# Altium schematic sheet USB_PHY.SchDoc
size A4; SheetNumber: 4; SheetTotal: 10
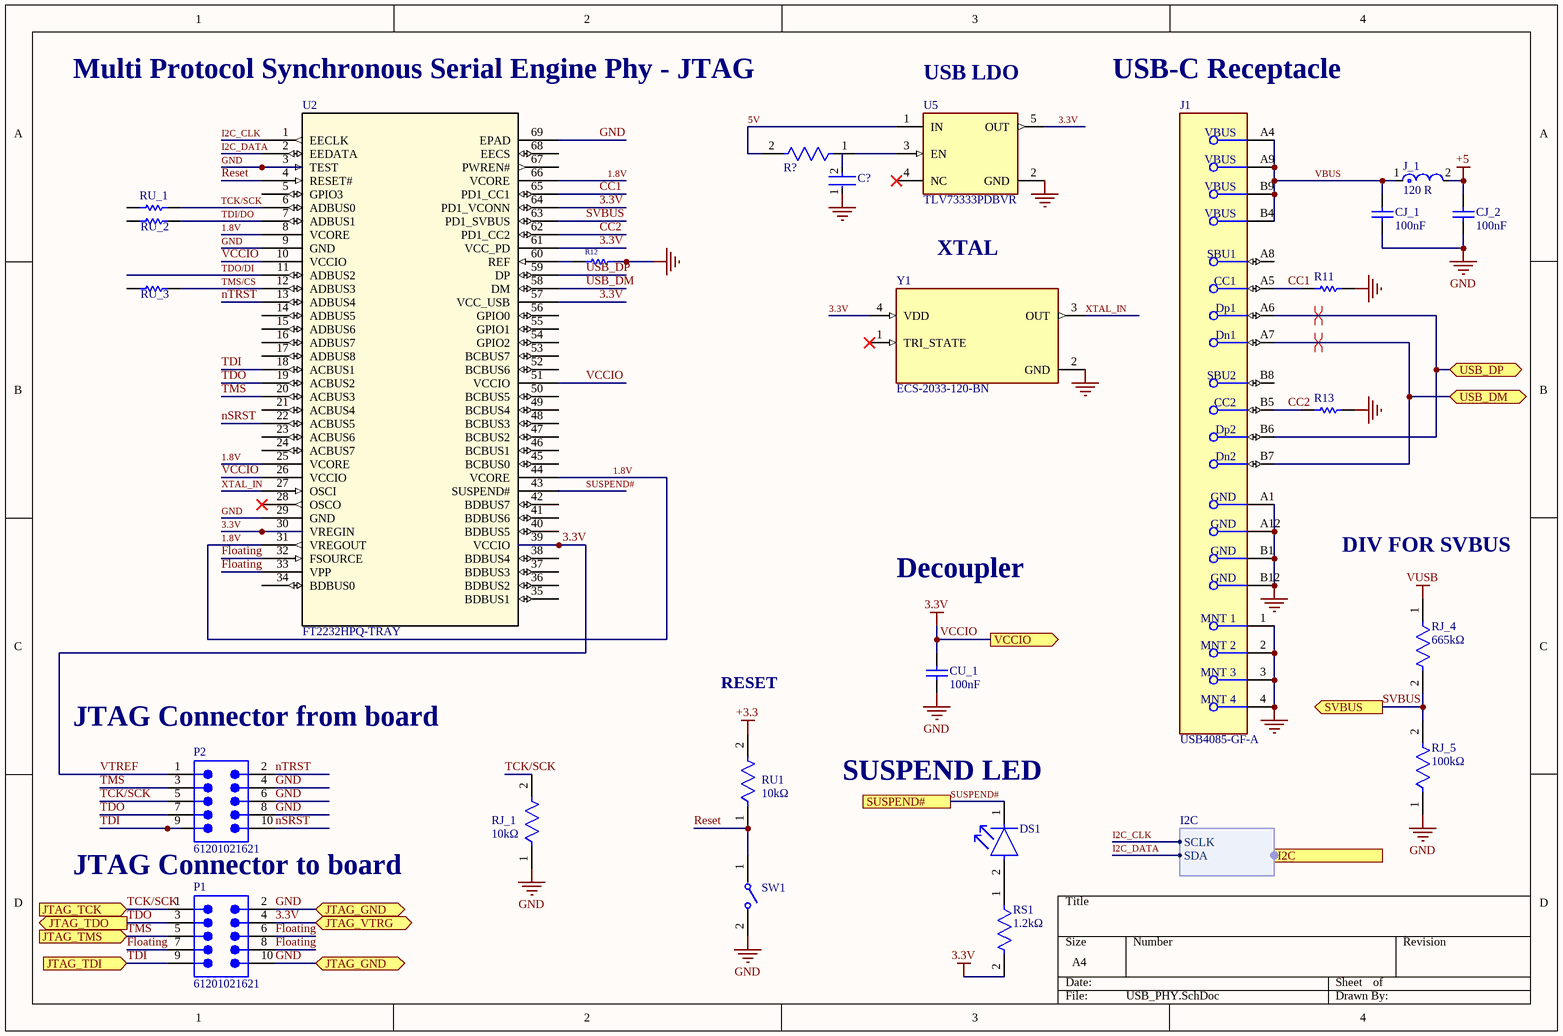
[diagram p0: USB_PHY.SchDoc]

## Parts
C?  C1608X5R1H105K080AB  [FP-C1608-080-0_1-IPC_B]  (value not drawn)
CJ_1  100nF  [CAPC1206(3216)170_L]
CJ_2  100nF  [CAPC1206(3216)170_L]
CU_1  100nF  [CAPC1206(3216)170_L]
DS1  LTST-C190GKT  [FP-LTST-C190GKT-MFG]  (value not drawn)
J1  USB4085-GF-A  [FP-USB4085-GF-A-MFG]
J_1  120 R  [FP-LQG15HH_02-MFG]
P1  61201021621  [61201021621]
P2  61201021621  [61201021621]
R11  MCRE000157  [RESC0603X26X15NL03T05]  (value not drawn)
R12  ERJ-2RKF1202X  [RESC1005X40X25ML05T05]  (value not drawn)
R13  MCRE000157  [RESC0603X26X15NL03T05]  (value not drawn)
R?  RC0603FR-0710KL  [FP-RC0603-0_55-IPC_C]  (value not drawn)
RJ_1  10kΩ  [FP-TFCR0805-IPC_B]
RJ_4  665kΩ  [FP-RK73H2B-IPC_C]
RJ_5  100kΩ  [FP-TFCR0402-IPC_B]
RS1  1.2kΩ  [FP-ESR10-IPC_B]
RU1  10kΩ  [FP-TFCR0805-IPC_B]
RU_1  MCSR04X33R0FTL  [RESC1005X40X25ML05T10]  (value not drawn)
RU_2  MCSR04X33R0FTL  [RESC1005X40X25ML05T10]  (value not drawn)
RU_3  MCSR04X33R0FTL  [RESC1005X40X25ML05T10]  (value not drawn)
SW1  B3U-1000P  [FP-B3U-1000P-MFG]  (value not drawn)
U2  FT2232HPQ-TRAY  [QFN68_FT2232_FTD]
U5  TLV73333PDBVR  [FP-DBV0005A-MFG]
Y1  ECS-2033-120-BN  [OSC_ECS-2033-120-BN]

## Ports
I2C (harness I2C, see root[2B], MCU[2C]), JTAG_GND (bidir), JTAG_TCK (in), JTAG_TDI (in), JTAG_TDO (out), JTAG_TMS (in), JTAG_VTRG (bidir), SUSPEND#, SVBUS (out), USB_DM (bidir), USB_DP (bidir), VCCIO (out)

## Harnesses
I2C: SCLK, SDA

## Nets
3.3V: CU_1.2 P1.4 P2.1 RS1.2 U2.10(VCCIO) U2.26(VCCIO) U2.30(VREGIN) U2.39(VCCIO) U2.51(VCCIO) U2.57(VCC_USB) U2.61(VCC_PD) U2.64(PD1_VCONN) U5.5(OUT) Y1.4(VDD) ; port VCCIO, port JTAG_VTRG  [also labelled VCCIO, VTREF]
+3.3: RU1.2
+5: CJ_2.2 J_1.2
GND: C?.1 CJ_1.1 CJ_2.1 CU_1.1 J1.1(MNT_1) J1.2(MNT_2) J1.3(MNT_3) J1.4(MNT_4) J1.A1(GND) J1.A12(GND) J1.B1(GND) J1.B12(GND) P1.2 P1.10 P2.4 P2.6 P2.8 R11.2 R12.2 R13.2 RJ_1.1 RJ_5.1 SW1.2 U2.3(TEST) U2.9(GND) U2.29(GND) U2.69(EPAD) U5.2(GND) Y1.2(GND) ; port JTAG_GND
VUSB: RJ_4.1
1.8V: U2.8(VCORE) U2.25(VCORE) U2.31(VREGOUT) U2.44(VCORE) U2.66(VCORE)
5V: R?.2 U5.1(IN)
CC1: J1.A5(CC1) R11.1 U2.65(PD1_CC1)
CC2: J1.B5(CC2) R13.1 U2.62(PD1_CC2)
Floating: P1.6 P1.7 P1.8 U2.32(FSOURCE) U2.33(VPP)
I2C_CLK: U2.1(EECLK) ; port I2C.SCLK
I2C_DATA: U2.2(EEDATA) ; port I2C.SDA
nSRST: P2.10 U2.22(ACBUS5)
nTRST: P2.2 U2.13(ADBUS4)
Reset: RU1.1 SW1.1 U2.4(RESET#)
SUSPEND#: DS1.1(C) U2.43(SUSPEND#) ; port SUSPEND#
SVBUS: RJ_4.2 RJ_5.2 U2.63(PD1_SVBUS) ; port SVBUS
TCK/SCK: P1.1 P2.5 RJ_1.2 RU_1.2 U2.6(ADBUS0) ; port JTAG_TCK
TDI: P1.9 P2.9 U2.18(ACBUS1) ; port JTAG_TDI
TDI/DO: RU_2.2 U2.7(ADBUS1)
TDO: P1.3 P2.7 U2.19(ACBUS2) ; port JTAG_TDO
TDO/DI: U2.11(ADBUS2)
TMS: P1.5 P2.3 U2.20(ACBUS3) ; port JTAG_TMS
TMS/CS: RU_3.2 U2.12(ADBUS3)
USB_DM: U2.58(DM)
USB_DM: J1.A7(Dn1) J1.B7(Dn2) ; port USB_DM  [a separate net that carries the same name]
USB_DP: U2.59(DP)
USB_DP: J1.A6(Dp1) J1.B6(Dp2) ; port USB_DP  [a separate net that carries the same name]
VBUS: CJ_1.2 J1.A4(VBUS) J1.A9(VBUS) J1.B4(VBUS) J1.B9(VBUS) J_1.1
XTAL_IN: U2.27(OSCI) Y1.3(OUT)
NetDS1_2: DS1.2(A) RS1.1
NetR12_1: R12.1 U2.60(REF)
NetR?_1: R?.1 U5.3(EN)

Not connected (* = marked no-connect by the designer): C? 2; J1 A8(SBU1) B8(SBU2); RU_1 1; RU_2 1; RU_3 1; U2 5(GPIO3) 14(ADBUS5) 15(ADBUS6) 16(ADBUS7) 17(ADBUS8) 21(ACBUS4) 23(ACBUS6) 24(ACBUS7) 28(OSCO)* 34(BDBUS0) 35(BDBUS1) 36(BDBUS2) 37(BDBUS3) 38(BDBUS4) 40(BDBUS5) 41(BDBUS6) 42(BDBUS7) 45(BCBUS0) 46(BCBUS1) 47(BCBUS2) 48(BCBUS3) 49(BCBUS4) 50(BCBUS5) 52(BCBUS6) 53(BCBUS7) 54(GPIO2) 55(GPIO1) 56(GPIO0) 67(PWREN#) 68(EECS); U5 4(NC)*; Y1 1(TRI_STATE)*

## Layout directives
differential pair; differential pair class *: USB_DM, USB_DP

## Notes on the sheet
- Multi Protocol Synchronous Serial Engine Phy - JTAG
- (near U5) USB LDO
- USB-C Receptacle
- XTAL
- Decoupler
- DIV FOR SVBUS
- RESET
- (near P2) JTAG Connector from board
- (near DS1) SUSPEND LED
- JTAG Connector to board

## Library data of the parts
C? = CMP-2000-06025-2: Multilayer Ceramic Capacitors 1μF ±10% 50V X5R SMD 0603; Capacitance: 1uF; Lead Free: Lead Free; Height: 0.8mm; Mount: Surface Mount; Radiation Hardening: No; Thickness: 0.035inch; Length: 1.6mm; Max Operating Temperature: 85°C; REACH SVHC: No SVHC; Min Operating Temperature: -55°C; Construction: Flat; RoHS Compliant: Yes; Voltage Rating: 50V; Dielectric: X5R; Packaging: Tape and Reel; Termination: SMD/SMT; Voltage Rating (DC): 50V; Case Code (Imperial): 0603; Voltage: 50V; Width: 0.031inch; Weight: 7.1E-05oz; Depth: 0.8mm; Case Code (Metric): 1608; Series: C; Case/Package: 0603; Tolerance: 10%; Resistor Type: Ceramic; Number of Pins: 2; Dielectric Material: Ceramic; Package Quantity: 1
CJ_1 CJ_2 CU_1 = CMP-1037-04188-1: CAP 100nF 25V ±5% 1206 (3216 Metric) Thickness 1.7mm SMD; Case-Metric: 3216; Case-EIA: 1206; Tolerance: Â±5%; Max Thickness: 1.7 mm; Value: 100nF; Technology: SMT; Rated Voltage: 25 V
DS1 = CMP-22017-000005-2: LED GREEN CLEAR CHIP SMD; Dominant Wavelength: 569nm; Reverse Voltage: 5V; Lens Color: Colorless; Viewing Angle: 130°; Voltage: 2V; Forward Current: 30mA; Power Dissipation: 100mW; Luminous Intensity: 6mcd; Number of LEDs: 1; Forward Voltage: 2.1V; Wavelength: 565nm; Test Current: 10mA; Min Operating Temperature: -55°C; Lens Style: Clear; Mount: Surface Mount; Width: 0.8mm; Packaging: Tape and Reel; Lens Transparency: Clear; Case Code (Metric): 1608; Depth: 0.8mm; Case Code (Imperial): 0603; Case/Package: 0603; Number of Pins: 2; Max Operating Temperature: 85°C; Lead Free: Lead Free; Number of Elements: 1; Length: 1.6mm; Height: 0.8mm; Package Quantity: 1; Power Rating: 100mW; Radiation Hardening: No; Illumination Color: Green; Color: Green
J1 = CMP-196119-000001-2: CONN RCPT USB2.0 TYPE C 24POS RA; Gender: Receptacle; Number of Positions: 16; USB Standard: USB 2.0; Orientation: Right Angle; Contact Plating: Gold; Contact Material: Copper Alloy
J_1 = CMP-06042-008586-1: Multilayer type RF Inductor 8.2nH ±5% 0.25Ω 500mA 0402; Core Material: Air; Shielding: Unshielded; Current Rating: 300mA; Test Frequency: 100MHz; Self Resonant Frequency: 3.6GHz; Q Factor: 8; DC Resistance (DCR): 330mR; Case/Package: 0402; Max Operating Temperature: 125°C; Military Standard: Not; Depth: 0.55mm; Lead Free: Lead Free; DC Current: 300mA; Length: 1mm; Height: 0.02inch; Width: 0.5mm; Termination: SMD/SMT; Max DC Current: 300mA; Min Operating Temperature: -55°C; Height - Seated (Max): 0.022inch; Radiation Hardening: No; Inductance: 8.2nH; Packaging: Tape and Reel; REACH SVHC: No SVHC; Case Code (Imperial): 0402; Package Quantity: 1; Tolerance: 5%; Case Code (Metric): 1005; Mount: Surface Mount; Inductance Tolerance: 5%
P1 P2 = CMP-1502-00007-2: NexarPartId: 8917783; Number of Contacts: 10; Voltage Rating (DC): 250V; Insulation Resistance: 1GΩ; Current Rating: 3A; Row Spacing: 2.54mm; Contact Resistance: 20mΩ; Connector Type: Male Pin; Gender: Male; Flammability Rating: UL94 V-0; Termination: Solder; Width: 20.36mm; Length: 20.36mm; Housing Material: PBT; Operating Supply Voltage: 250V; Min Operating Temperature: -40°C; Lead Free: Lead Free; Insulation Material: PBT; Orientation: Vertical; RoHS: Compliant; Voltage Rating: 250V; Number of Pins: 10; Height: 8.85mm; REACH SVHC: Unknown; Contact Material: Copper; Contact Gender: Male; Color: Black; Mount: Through Hole; Contact Plating: Gold; Lead Pitch: 2.54mm; Number of Positions: 10; Pitch: 2.54mm; Max Operating Temperature: 105°C; Number of Rows: 2
R11 R13 = CMP-2004-02525-1: Manufacturer: Multicomp; Part Number: MCRE000157
R12 = CMP-2002-00646-4: Chip Resistor, 12 KOhm, +/- 1%, 0.1 W, -55 to 155 degC, 0402 (1005 Metric), RoHS, Tape and Reel; Resistance: 12 KOhm; Voltage Rating: 50 V; Case\/Package: 0402; Power Rating: 100 mW; Length: 1 mm; PackageReference: 0402; DatasheetVersion: 04/2015; ComponentLink2Description: Datasheet; ComponentLink1URL: http://www.panasonic.com/; Pins: 2; Width: 0.5 mm; REACH SVHC: Yes; Packaging: Tape and Reel; Min Operating Temperature: -55 degC; Mounting Technology: Surface Mount; Max Operating Temperature: 155 degC; Case Code (Imperial): 0402; Height: 0.35 mm; Tolerance: 1%; PackageDescription: 2-Pin Surface Mount Device, Body 1 x 0.5 mm; RoHSCompliant: true; ComponentLink1Description: Manufacturer URL; Mount: Surface Mount; ComponentLink2URL: http://industrial.panasonic.com/cdbs/www-data/pdf/RDA0000/AOA0000C86.pdf; Package Quantity: 10000; Case Code (Metric): 1005; PartNumber: ERJ-2RKF1202X
R? = CMP-2100-03664-2: RES 10K OHM 1% 1/10W 0603; Voltage Rating: 75V; Voltage Rating (DC): 50V; Resistance: 10kR; Power Rating: 100mW; Temperature Coefficient: 100ppm/°C; Depth: 0.8mm; Termination: SMD/SMT; Resistor Type: Thick Film; Series: RC; Construction: Rectangular; Features: Moisture Resistant; Packaging: Tape and Reel; Min Operating Temperature: -55°C; Number of Terminations: 2; Lead Pitch: 0.3mm; RoHS Compliant: Yes; Case/Package: 0603; Resistance Tolerance: 1%; Military Standard: Not; Weight: 7.1E-05oz; Number of Pins: 2; Tolerance: 1%; Length: 1.6mm; Case Code (Imperial): 0603; Lead Free: Lead Free; Width: 0.8mm; Max Power Dissipation: 100mW; Height: 0.45mm; Max Operating Temperature: 155°C; Case Code (Metric): 1608; Size Code: 0603
RJ_1 RU1 = CMP-250906-173936-1: RES Thin Film,  10kΩ, 0.1%, 0.1W, 50ppm/°C, 0805
RJ_4 = CMP-04015-080795-1: 665kΩ ±1% 0.25W Chip Resistor 1206 Thick Film AEC-Q200 Qualified; Resistance: 665kR; Voltage Rating: 200V; Power Rating: 250mW; Temperature Coefficient: 100ppm/°C; Height: 0.6mm; Case Code (Metric): 3216; Case Code (Imperial): 1206; Width: 1.6mm; Package Quantity: 5000; Lead Free: Contains Lead; Max Operating Temperature: 155°C; Tolerance: 1%; Packaging: Tape and Reel; Voltage Rating (DC): 200V; Termination: SMD/SMT; Min Operating Temperature: -55°C; Case/Package: 1206; RoHS Compliant: No; Length: 3.2mm; Series: RK73H
RJ_5 = CMP-250906-202248-1: RES Thin Film,  100kΩ, 0.5%, 0.063W, 25ppm/°C, 0402
RS1 = CMP-08839-028157-1: 1.2kΩ ±5% 0.4W 0805 Anti-Surge Chip Resistor AEC-Q200; Temperature Coefficient: 200ppm/°C; Max Power Dissipation: 400mW; Resistance: 1.2kR; Power Rating: 250mW; Size Code: 0805; Max Operating Temperature: 155°C; Min Operating Temperature: -55°C; Features: Automotive AEC-Q200; Length: 0.079inch; Height: 0.026inch; Case Code (Metric): 2012; Package Quantity: 1; Case Code (Imperial): 0805; RoHS Compliant: Yes; Case/Package: 0805; Packaging: Tape and Reel; Resistor Type: Thick Film; Series: ESR; Number of Terminations: 2; Width: 0.049inch; Tolerance: 5%; Lead Free: Lead Free
RU_1-RU_3 = CMP-2002-06936-1: Manufacturer: Multicomp; Part Number: MCSR04X33R0FTL
SW1 = CMP-2100-03586-2: SWITCH TACTILE SPST-NO 0.05A 12V; Contact Resistance: 100mR; Operating Force: 1.5N; Max Current Rating: 50mA; Switch Travel: 0.15mm; Actuator Type: Standard; Mechanical Life: 200000Cycles; Ratings: Dust Proof; Illumination Type: Non-Illuminated; Throw Configuration: SPST; Actuator Length: 0.4mm; Switch Function: Off-Mom; Height: 1.2mm; Width: 3mm; Weight: 0.000776oz; Contact Material: Silver; Max Voltage Rating (DC): 12V; Insulation Resistance: 100MR; Lead Free: Lead Free; Current Rating: 50mA; Termination: SMD/SMT; Length: 4mm; Voltage Rating (DC): 12V; Contact Current Rating: 50mA; Orientation: Straight; Depth: 2.5mm; Max Operating Temperature: 70°C; Packaging: Tape and Reel; Min Operating Temperature: -25°C; Package Quantity: 1; Mount: Surface Mount; Electrical Life: 200000Cycles
U2 = FT2232HPQ-TRAY: No Description Available; Manufacturer_Name: FTDI, Future Technology Devices International Ltd; Type: Interface; Copyright: Copyright (C) 2025 Ultra Librarian. All rights reserved.; Manufacturer_Part_Number: FT2232HPQ-TRAY; RefDes: RefDes
U5 = CMP-04917-000053-1: IC REG LINEAR 3.3V 300MA SOT23-5; Manufacturer: Texas Instruments; Max Junction Temp: +125°C; Accuracy Percentage: 1%; Min Supply Voltage: 1.4V; Number Of Outputs: 1; Dropout Voltage: 125mV; Nominal Supply Current: 34uA; Max Supply Voltage: 5.5V; Output Type: Fixed; Standoff Height: 0mm; Digikey Description: IC REG LINEAR 3.3V 300MA SOT23-5; Manufacturer Part Number: TLV73333PDBVR; Temperature Range High: +125°C; Temperature: -40°C to +125°C; Output Current: 300mA; Mouser Description: LDO Voltage Regulators Capacitr-Free 300-mA 5-SOT-23 -40 to 125; Automotive: No; Height: 1.45mm; Device Class L3: Voltage Regulators - Linear; ComponentLink2Description: Datasheet; Device Class L1: Integrated Circuits (ICs); ComponentLink2URL: http://www.ti.com/lit/ds/symlink/tlv733p.pdf; Octopart: https://octopart.com/tlv73333pdbvr-texas+instruments-51080890; Temperature Range Low: -40°C; RoHS: TRUE; Lead Free: Yes; Output Voltage: 3.3V; Package: DBV0005A; Device Class L2: Power Management ICs; Category: IC
Y1 = ECS-2033-120-BN: 12 MHz XO (Standard) CMOS Oscillator 3.3V Enable/Disable 4-SMD, No Lead; MF: ECS Inc.; SnapEDA_Link: https://www.snapeda.com/parts/ECS-2033-120-BN/ECS/view-part/?ref=snap; Package: ECS-2033-4 ECS; Value: *; MP: ECS-2033-120-BN; Check_prices: https://www.snapeda.com/parts/ECS-2033-120-BN/ECS/view-part/?ref=eda